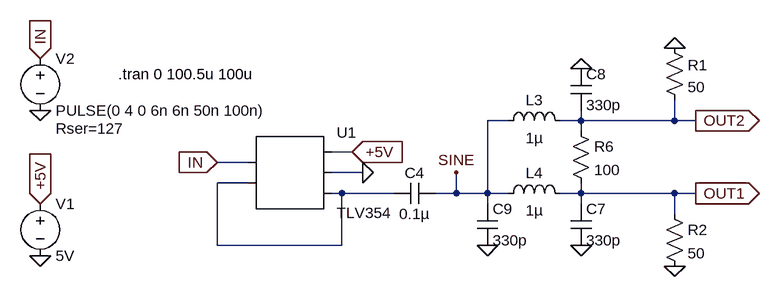
[diagram p0: schematic output-amplifier-sim.asc]
output-amplifier-sim.asc, the LTspice schematic file:
Version 4
SHEET 1 1540 680
WIRE 304 -64 272 -64
WIRE 416 -64 416 -80
WIRE 416 -64 384 -64
WIRE 560 -64 560 -96
WIRE 560 -64 416 -64
WIRE 592 -64 560 -64
WIRE 416 -48 416 -64
WIRE 64 -16 32 -16
WIRE -96 0 -144 0
WIRE 80 16 32 16
WIRE -96 32 -144 32
WIRE 48 48 32 48
WIRE 128 48 48 48
WIRE 224 48 224 16
WIRE 224 48 192 48
WIRE 272 48 272 -64
WIRE 272 48 224 48
WIRE 304 48 272 48
WIRE 416 48 416 32
WIRE 416 48 384 48
WIRE 560 48 416 48
WIRE 592 48 560 48
WIRE 272 64 272 48
WIRE 416 64 416 48
WIRE 560 80 560 48
WIRE -144 128 -144 32
WIRE 48 128 48 48
WIRE 48 128 -144 128
FLAG -416 144 0
FLAG 592 48 OUT1
IOPIN 592 48 Out
FLAG -416 -80 0
FLAG 560 160 0
FLAG 560 -176 0
FLAG 592 -64 OUT2
IOPIN 592 -64 Out
FLAG -416 -160 IN
IOPIN -416 -160 In
FLAG -416 64 +5V
IOPIN -416 64 In
FLAG 64 -16 +5V
IOPIN 64 -16 In
FLAG -144 0 IN
IOPIN -144 0 In
FLAG 224 16 SINE
FLAG 416 -144 0
FLAG 416 128 0
FLAG 272 128 0
FLAG 80 16 0
SYMBOL voltage -416 48 R0
WINDOW 123 0 0 Left 0
WINDOW 39 0 0 Left 0
SYMATTR InstName V1
SYMATTR Value 5V
SYMBOL voltage -416 -176 R0
WINDOW 123 0 0 Left 0
WINDOW 39 24 124 Left 2
SYMATTR SpiceLine Rser=127
SYMATTR InstName V2
SYMATTR Value PULSE(0 4 0 6n 6n 50n 100n)
SYMBOL res 544 64 R0
SYMATTR InstName R2
SYMATTR Value 50
SYMBOL res 544 -192 R0
WINDOW 0 36 42 Left 2
SYMATTR InstName R1
SYMATTR Value 50
SYMBOL cap 192 32 R90
WINDOW 0 0 32 VBottom 2
WINDOW 3 32 32 VTop 2
SYMATTR InstName C4
SYMATTR Value 0.1µ
SYMBOL res 400 -64 R0
SYMATTR InstName R6
SYMATTR Value 100
SYMBOL ind 288 -48 R270
WINDOW 0 32 56 VTop 2
WINDOW 3 5 56 VBottom 2
SYMATTR InstName L3
SYMATTR Value 1µ
SYMATTR SpiceLine Rser=400m
SYMBOL ind 288 64 R270
WINDOW 0 32 56 VTop 2
WINDOW 3 5 56 VBottom 2
SYMATTR InstName L4
SYMATTR Value 1µ
SYMATTR SpiceLine Rser=400m
SYMBOL cap 400 64 R0
SYMATTR InstName C7
SYMATTR Value 330p
SYMBOL cap 400 -144 R0
SYMATTR InstName C8
SYMATTR Value 330p
SYMBOL cap 256 64 R0
SYMATTR InstName C9
SYMATTR Value 330p
SYMBOL AutoGenerated\\TLV354 -32 16 R0
SYMATTR InstName U1
TEXT -296 -136 Left 2 !.tran 0 100.5u 100u

The netlist it stands for:
* output-amplifier-sim.asc
V1 +5V 0 5V
V2 IN 0 PULSE(0 4 0 6n 6n 50n 100n) Rser=127
R2 OUT1 0 50
R1 0 OUT2 50
C4 SINE N001 0.1µ
R6 OUT2 OUT1 100
L3 SINE OUT2 1µ Rser=400m
L4 SINE OUT1 1µ Rser=400m
C7 OUT1 0 330p
C8 0 OUT2 330p
C9 SINE 0 330p
* U1: TLV354 (symbol AutoGenerated\TLV354 not available, pins judged from their places): pin1=IN pin2=N001 pin3=+5V pin4=0 pin5=N001
.tran 0 100.5u 100u
.backanno
.end